# Altium schematic sheet 03_pushswitch.SchDoc
size A
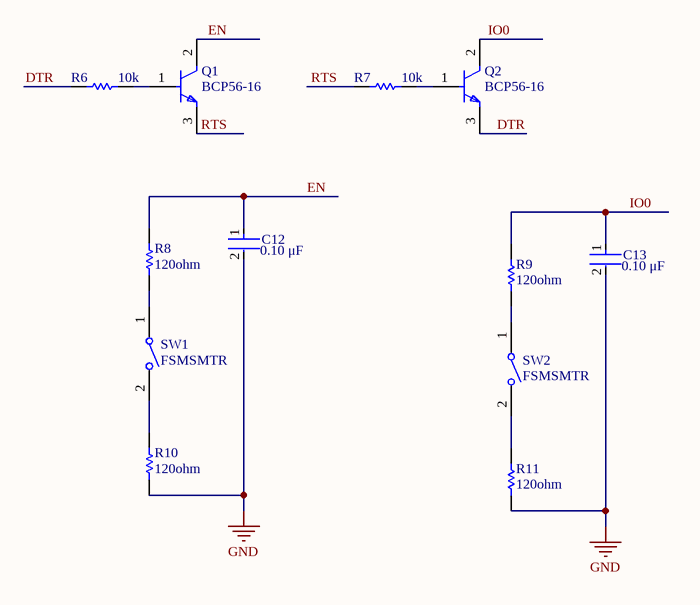
[diagram p0: 03_pushswitch.SchDoc]

## Parts
C12  Capacitance: 0.10 μF  [FP-C0603C-CF-MFG]  (hidden comment: C0603C104M4RAC7411)
C13  Capacitance: 0.10 μF  [FP-C0603C-CF-MFG]  (hidden comment: C0603C104M4RAC7411)
Q1  BCP56-16  [FP-SOT-223-P008-MFG]
Q2  BCP56-16  [FP-SOT-223-P008-MFG]
R6  value 10k  [RESC1609X55X30LL15T15]  (hidden comment: ERJ3EKF1002V)
R7  value 10k  [RESC1609X55X30LL15T15]  (hidden comment: ERJ3EKF1002V)
R8  value 120ohm  [RESC1608X55X30NL20T20]  (hidden comment: ERA-3AEB121V)
R9  value 120ohm  [RESC1608X55X30NL20T20]  (hidden comment: ERA-3AEB121V)
R10  value 120ohm  [RESC1608X55X30NL20T20]  (hidden comment: ERA-3AEB121V)
R11  value 120ohm  [RESC1608X55X30NL20T20]  (hidden comment: ERA-3AEB121V)
SW1  FSMSMTR  [TECO-FSMSMTR_V]
SW2  FSMSMTR  [TECO-FSMSMTR_V]

## Nets
GND: C12.2 C13.2 R10.1 R11.1
DTR: Q2.3(E) R6.1
EN: C12.1 Q1.2(C) R8.2
IO0: C13.1 Q2.2(C) R9.2
RTS: Q1.3(E) R7.1
NetQ1_1: Q1.1(B) R6.2
NetQ2_1: Q2.1(B) R7.2
NetR8_1: R8.1 SW1.1
NetR9_1: R9.1 SW2.1
NetR10_2: R10.2 SW1.2
NetR11_2: R11.2 SW2.2

## Library data of the parts
C12 C13 = CMP-03020-016578-1: CAP CER 0.1UF 16V X7R 0603; Manufacturer: KEMET; Tolerance: 0.2; Value: 0.10 μF; Automotive Grade: Grade 1; Material: Ceramic; Temperature Coefficient: 30ppm/°C; RoHS: TRUE; Temperature: -55°C to +125°C; Automotive: Yes; Device Class L3: Ceramic Capacitors; Temperature Characteristic: X7R; Package: C0603C-CF; Digikey Description: CAP CER 0.1UF 16V X7R 0603; Manufacturer Part Number: C0603C104M4RAC7411; ComponentLink2URL: https://api.kemet.com/component-edge/download/datasheet/C0603C100J5GACAUTO.pdf; Mouser Description: Multilayer Ceramic Capacitors MLCC - SMD/SMT 16volts 0.1uF X7R 20%; Voltage Rating: 16 V; Temperature Range High: +125°C; Temperature Range Low: -55°C; Height: 0.87mm; Device Class L1: Passive Components; ComponentLink2Description: Datasheet; Lead Free: Yes; Category: Cap; Device Class L2: Capacitors; Octopart: https://octopart.com/c0603c104m4rac7411-kemet-9138805
Q1 Q2 = CMP-12195-000003-1: TRANS NPN 80V 1A SOT-223; Manufacturer: STMicroelectronics; Number Of Npn: 1; Hfe Max: 250; Hfe Min: 100; Power Dissipation: 1.6W; Collector Base Voltage: 100V; Emitter Base Voltage: 5V; Max Junction Temp: +150°C; Rthja Max: 78°C/W; Standoff Height: 0.02mm; Collector Emitter Saturation Voltage: 0.5V; Hfe Testvce: 2V; Hfe Testic: 150mA; Package: SOT-223-P008; Octopart: https://octopart.com/bcp56-16-stmicroelectronics-13883839; Digikey Description: TRANS NPN 80V 1A SOT-223; RoHS: TRUE; Device Class L1: Discrete Semiconductors; Manufacturer Part Number: BCP56-16; Collector Emitter Voltage: 80V; Mouser Description: BCP56 Series 80 V 1 A 1.6 W Surface Mount Low Power NPN Transistor - SOT-223; Collector Emitter Breakdown Voltage: 80V; Category: Trans; Automotive: No; Ipc Land Pattern Name: SOT230P700X180-4; Temperature: to +150°C; Number Of Elements: 1; Footprint Url: https://www.st.com/content/ccc/resource/technical/document/application_note/45/cc/69/ea/2f/8d/4e/3c/CD00004438.pdf/files/CD00004438.pdf/jcr:content/translations/en.CD00004438.pdf; ComponentLink2URL: https://www.st.com/resource/en/datasheet/bcp56-16.pdf; Device Class L2: Transistors; Temperature Range High: +150°C; Device Class L3: BJTs; Height: 1.82mm; ComponentLink2Description: Datasheet; Lead Free: Yes; Max Collector Current: 1A
R6 R7 = CMP-2000-07452-1: Chip Resistor, 10 KOhm, +/- 1%, 0.1 W, -55 to 155 degC, 0603 (1608 Metric), RoHS, Tape and Reel; Manufacturer: Panasonic; Voltage Rating: 75V; Case\/Package: 0603; Power Rating: 100mW; Resistance: 10KOhm; Temperature Coefficient: 100ppm\/degreesC; Number of Pins: 2; Package Reference: 603; Depth: 0.8mm; Mount: SurfaceMount; Package Description: 2-Pin Surface Mount Device, Body 1.6 x 0.85 mm; Datasheet Version: 02/2017; Length: 1.6mm; Lead Free: LeadFree; Height: 0.45mm; Number of Terminations: 2; Max Power Dissipation: 100mW; Min Operating Temperature: -55degC; Datasheet URL: https://industrial.panasonic.com/cdbs/www-data/pdf/RDA0000/AOA0000C304.pdf; Termination: SMD/SMT; Case Code (Metric): 1608; Case Code (Imperial): 0603; Tolerance: 1%; Max Operating Temperature: 155degC; RoHSCompliant: true; Voltage Rating (DC): 75V; Radiation Hardening: No; Packaging: TapeandReel; Composition: ThickFilm; Mounting Technology: SurfaceMount; Manufacturer URL: http://www.panasonic.com/; Width: 0.031inch; REACH SVHC: NoSVHC; Contact Plating: Tin; Military Standard: Not; Package Quantity: 1
R8-R11 = CMP-2000-00896-1: Manufacturer: Panasonic; Part Number: ERA-3AEB121V
SW1 SW2 = CMP-2000-07501-1: FSMSM Push Button Switch, 50 mA, -35 to 85 degC, 2-Pin SMD, RoHS, Tape and Reel; Manufacturer: TE Connectivity; Voltage Rating (DC): 24V; Electrical Life: 20000Cycles; Operating Force: 180gf; Switch Travel: 0.25mm; Contact Current Rating: 50mA; Case\/Package: SMD/SMT; Actuator Length: 1.07mm; Throw Configuration: SPST; Actuator Material: Polyamide; Contact Resistance: 100mOhm; Illumination Type: Illuminated; Max Voltage Rating (DC): 12V; Manufacturer URL: http://www.te.com/; Lead Free: LeadFree; Packaging: TapeandReel; Min Operating Temperature: -35degC; Mechanical Life: 20000Cycles; Mount: SurfaceMount; REACH SVHC: Unknown; Package Quantity: 1800; Package Reference: FSMSMTR; RoHSCompliant: true; Max Operating Temperature: 85degC; Orientation: Straight; ELV: Compliant; Datasheet URL: http://www.te.com/commerce/DocumentDelivery/DDEController?Action=showdoc&DocId=Customer+Drawing%7F1437566-3%7FC2%7Fpdf%7FEnglish%7FENG_CD_1437566-3_C2_1437566_3_1_c.dwg.pdf%7F1437566-4; Package Description: 2-Pin Surface Mount Device, Body 6 x 3.5 mm, Pitch 9.19 mm; Current Rating: 50mA; Contact Plating: Silver; Termination: GullWing; Datasheet Version: Rev. C2, 08/2014; Contact Material: Brass; Mounting Technology: SurfaceMount